# EAGLE design Frontboard_TIC (EAGLE 9.0.1)
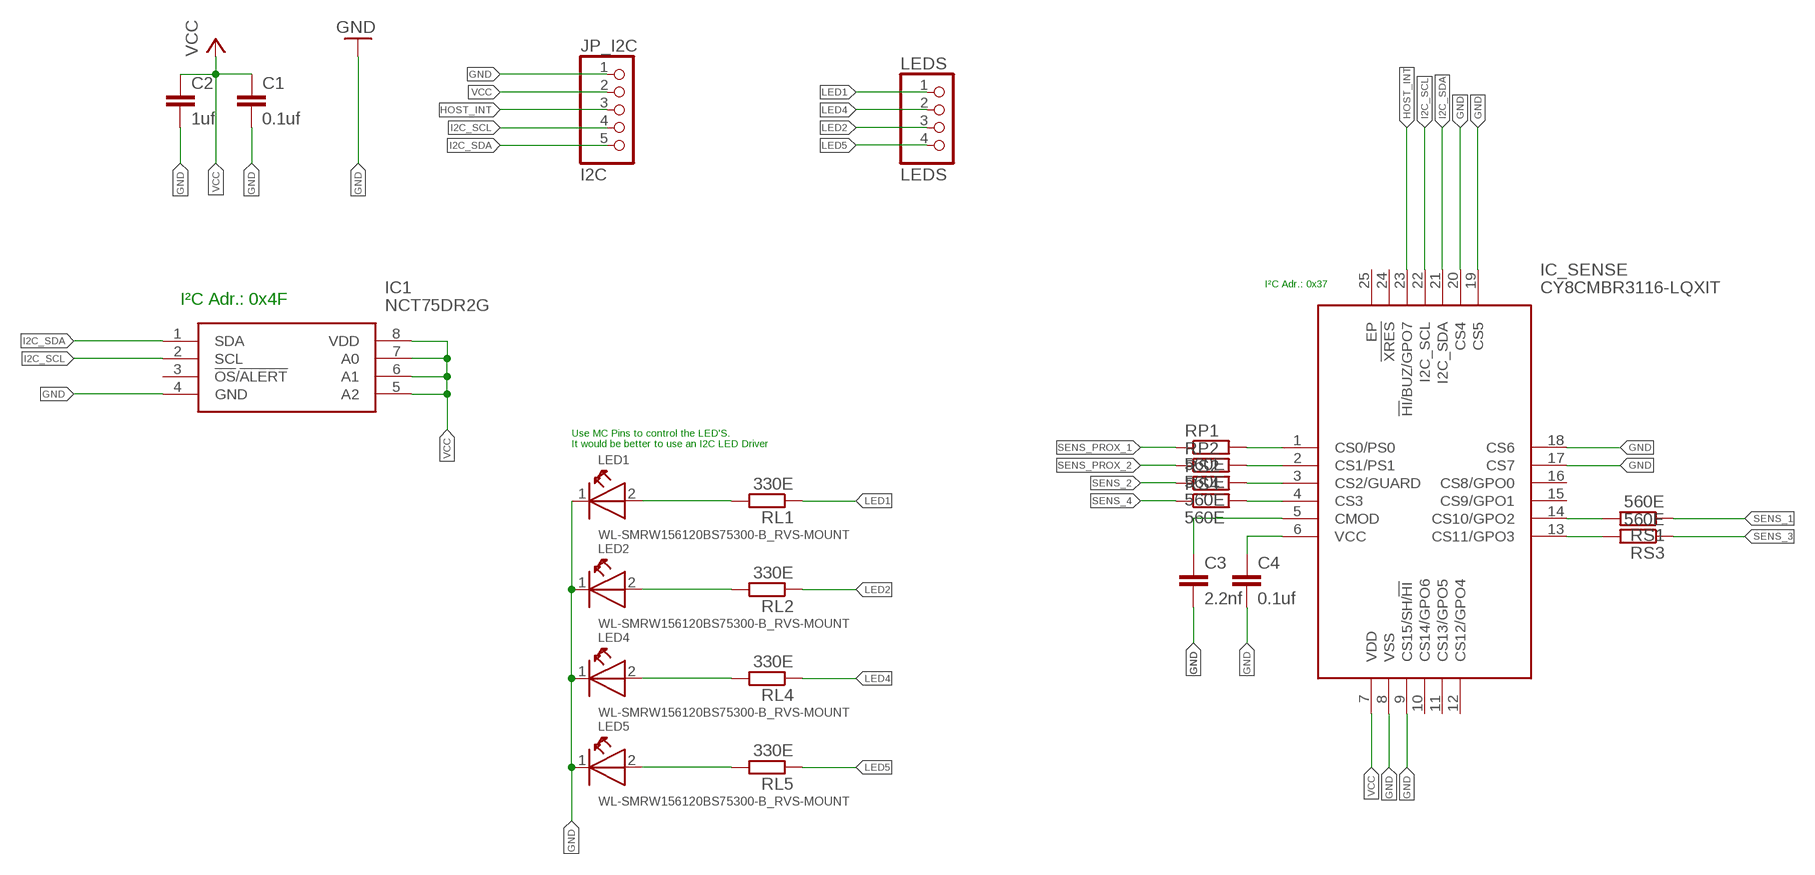
[diagram p0: schematic, sheet 1]

## Parts
C1  0.1uf  C-EUC0805  [C0805]
C2  1uf  C-EUC0805  [C0805]
C3  2.2nf  C-EUC0805  [C0805]
C4  0.1uf  C-EUC0805  [C0805]
IC1  NCT75DR2G  [SOIC127P600X175-8N]
IC_SENSE  CY8CMBR3116-LQXIT  [QFN50P400X400X60-25N]
JP_I2C  I2C  PINHD-1X5_2.54-SMD  [1X05SMD]
LED1  WL-SMRW156120BS75300-B_RVS-MOUNT  [WL-SMRW-1206-CYLDR-REVERSE-MOUNT]
LED2  WL-SMRW156120BS75300-B_RVS-MOUNT  [WL-SMRW-1206-CYLDR-REVERSE-MOUNT]
LED4  WL-SMRW156120BS75300-B_RVS-MOUNT  [WL-SMRW-1206-CYLDR-REVERSE-MOUNT]
LED5  WL-SMRW156120BS75300-B_RVS-MOUNT  [WL-SMRW-1206-CYLDR-REVERSE-MOUNT]
LEDS  LEDS  PINHD-1X4_2.54-SMD  [1X04SMD]
RL1  330E  R-EU_R0805  [R0805]
RL2  330E  R-EU_R0805  [R0805]
RL4  330E  R-EU_R0805  [R0805]
RL5  330E  R-EU_R0805  [R0805]
RP1  560E  R-EU_R0805  [R0805]
RP2  560E  R-EU_R0805  [R0805]
RS1  560E  R-EU_R0805  [R0805]
RS2  560E  R-EU_R0805  [R0805]
RS3  560E  R-EU_R0805  [R0805]
RS4  560E  R-EU_R0805  [R0805]

## Nets
GND: C1.2 C2.2 C3.2 C4.2 IC1.4(GND) IC_SENSE.8(VSS) IC_SENSE.9(CS15/SH/!HI) IC_SENSE.17(CS7) IC_SENSE.18(CS6) IC_SENSE.19(CS5) IC_SENSE.20(CS4) JP_I2C.1 LED1.1(K) LED2.1(K) LED4.1(K) LED5.1(K)
HOST_INT: IC_SENSE.23(!HI!/BUZ/GPO7) JP_I2C.3
I2C_SCL: IC1.2(SCL) IC_SENSE.22(I2C_SCL) JP_I2C.4
I2C_SDA: IC1.1(SDA) IC_SENSE.21(I2C_SDA) JP_I2C.5
LED1: LEDS.1 RL1.1
LED2: LEDS.3 RL2.1
LED4: LEDS.2 RL4.1
LED5: LEDS.4 RL5.1
N$1: LED1.2(A) RL1.2
N$2: LED2.2(A) RL2.2
N$3: IC_SENSE.14(CS10/GPO2) RS1.2
N$4: IC_SENSE.13(CS11/GPO3) RS3.2
N$5: IC_SENSE.1(CS0/PS0) RP1.2
N$6: IC_SENSE.2(CS1/PS1) RP2.2
N$7: IC_SENSE.4(CS3) RS4.2
N$8: IC_SENSE.3(CS2/GUARD) RS2.2
N$9: LED4.2(A) RL4.2
N$10: LED5.2(A) RL5.2
N$19: C4.1 IC_SENSE.6(VCC)
N$20: C3.1 IC_SENSE.5(CMOD)
SENS_1: RS1.1
SENS_2: RS2.1
SENS_3: RS3.1
SENS_4: RS4.1
SENS_PROX_1: RP1.1
SENS_PROX_2: RP2.1
VCC: C1.1 C2.1 IC1.5(A2) IC1.6(A1) IC1.7(A0) IC1.8(VDD) IC_SENSE.7(VDD) JP_I2C.2
Unconnected: IC1.3(!OS!/!ALERT) IC_SENSE.10(CS14/GPO6) IC_SENSE.11(CS13/GPO5) IC_SENSE.12(CS12/GPO4) IC_SENSE.15(CS9/GPO1) IC_SENSE.16(CS8/GPO0) IC_SENSE.24(!XRES) IC_SENSE.25(EP)

## Notes on the sheet
- I²C Adr.: 0x37
- I²C Adr.: 0x4F
- Use MC Pins to control the LED'S. 
  It would be better to use an I2C LED Driver

## Library data of the parts
C1-C4 = rcl:C-EU: CAPACITOR, European symbol; SPICEPREFIX: C
IC1 = NCT75DR2G:NCT75DR2G: Source: Datasheet <http://www.onsemi.com/pub/Collateral/NCT75-D.PDF>; ALLIED_NUMBER: 70467171; ALLIED_PRICE/STOCK: http://www.alliedelec.com/on-semiconductor-nct75dr2g/70467171/; ARROW_PART_NUMBER: NCT75DR2G; ARROW_PRICE/STOCK: https://www.arrow.com/en/products/nct75dr2g/on-semiconductor; HEIGHT: 1.75mm; MANUFACTURER_NAME: ON Semiconductor; MANUFACTURER_PART_NUMBER: NCT75DR2G; RS_PART_NUMBER: 8051854P; RS_PRICE/STOCK: http://uk.rs-online.com/web/p/products/8051854P
IC_SENSE = CY8CMBR3116-LQXIT:CY8CMBR3116-LQXIT: CYPRESS SEMICONDUCTOR - CY8CMBR3116-LQXIT - CAPACITIVE TOUCH SENSOR, I2C, QFN-24 Source: Datasheet <http://www.cypress.com/file/46236/download>; ARROW_PART_NUMBER: CY8CMBR3116-LQXIT; ARROW_PRICE/STOCK: https://www.arrow.com/en/products/cy8cmbr3116-lqxit/cypress-semiconductor; DESCRIPTION: CYPRESS SEMICONDUCTOR - CY8CMBR3116-LQXIT - CAPACITIVE TOUCH SENSOR, I2C, QFN-24; HEIGHT: 0.6mm; MANUFACTURER_NAME: Cypress Semiconductor; MANUFACTURER_PART_NUMBER: CY8CMBR3116-LQXIT
JP_I2C = pinhead:PINHD-1X5: PIN HEADER
LED1 LED2 LED4 LED5 = Wurth_Elektronik_Optoelectronics_rev15b (1):WL-SMRW: SMD Reverse mount mono-color rectangular Characteristics Small size & thin body for space saving Ideal for narrow space applications Wide viewing angle Low power consumption Industry standard footprint Small package for exceptional brightness To emit light through a small cut-out hole in PCB Compatible with automatic placement machine Applications Front panel indicators LCD backlighting Keypad backlighting Push button backlighting Symbol and switch backlighting General lighting <http://katalog.we-online.de/media/images/eipal/WL-SMRW_pf2.jpg> Details see: http://katalog.we-online.de/en/led/WL-SMRW?m Updated 2015-04-10 2015 (C) Wurth Elektronik
LEDS = pinhead:PINHD-1X4: PIN HEADER
RL1 RL2 RL4 RL5 RP1 RP2 RS1-RS4 = resistor:R-EU_: RESISTOR, European symbol

## Net classes
0 default: width 0.203 mm

## Board
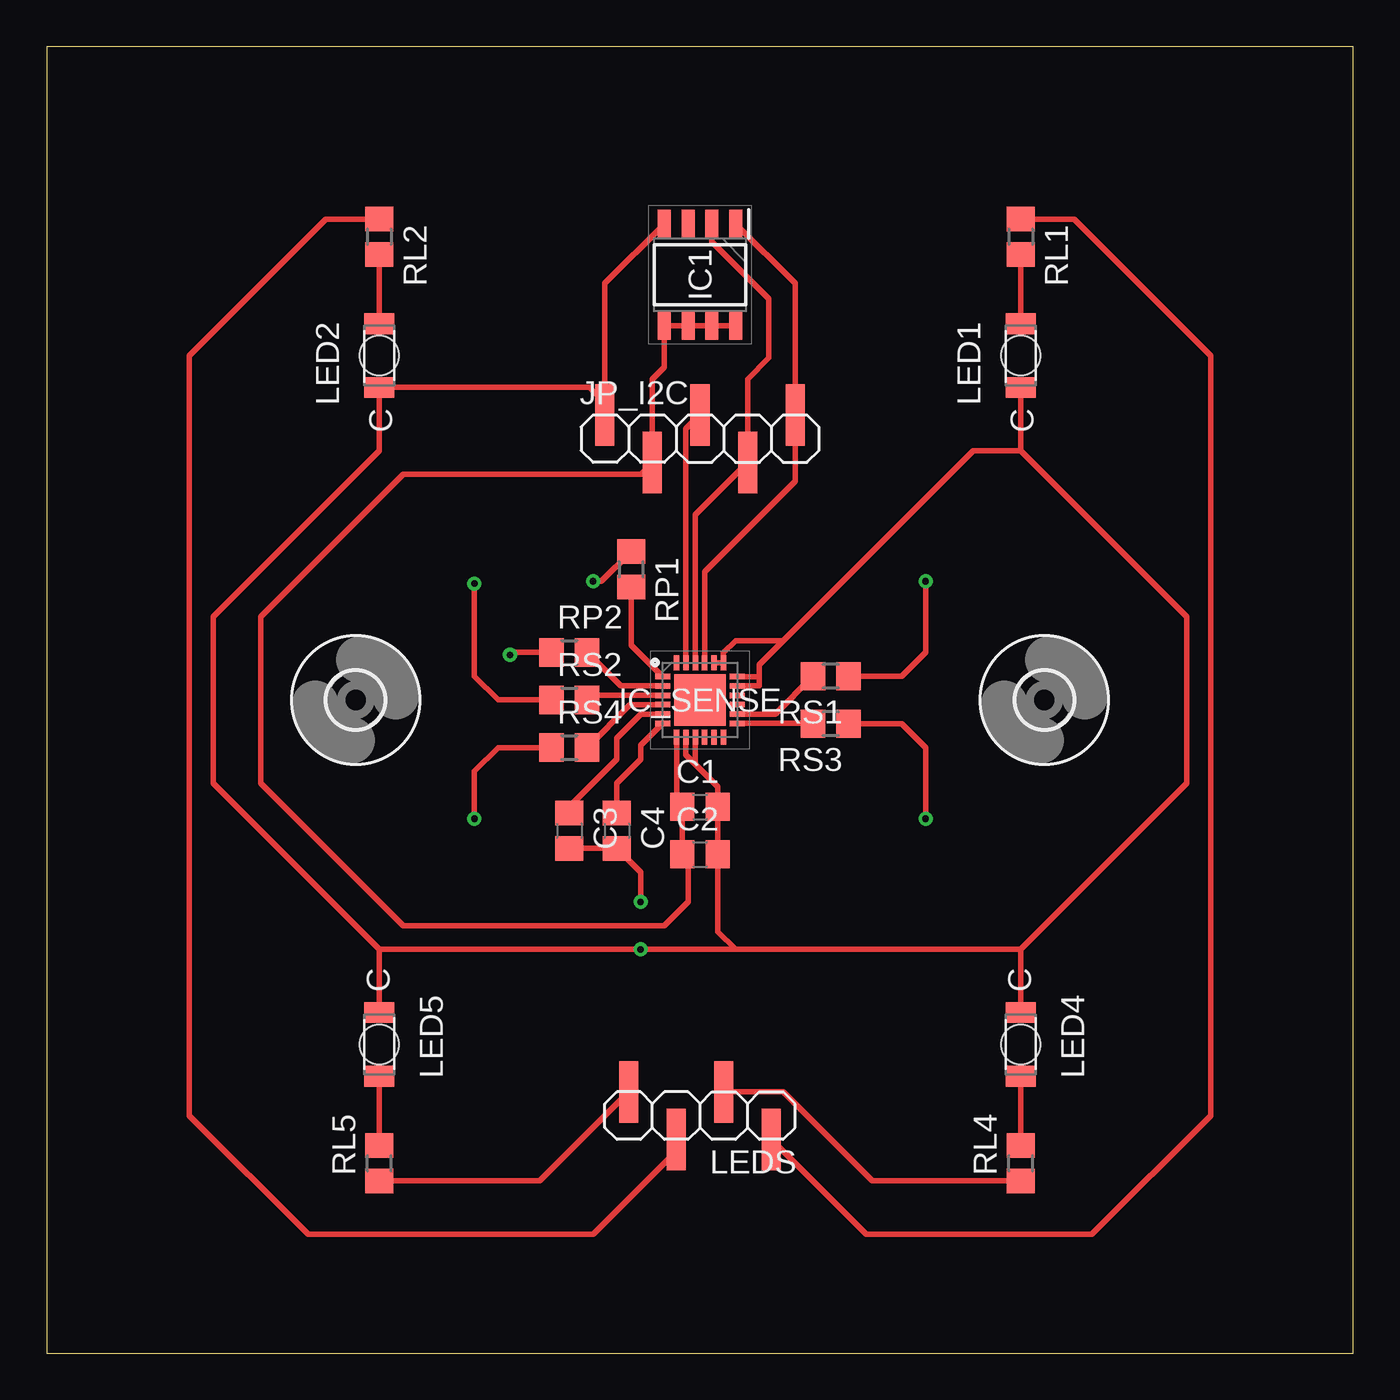
[diagram p1: board, top side]
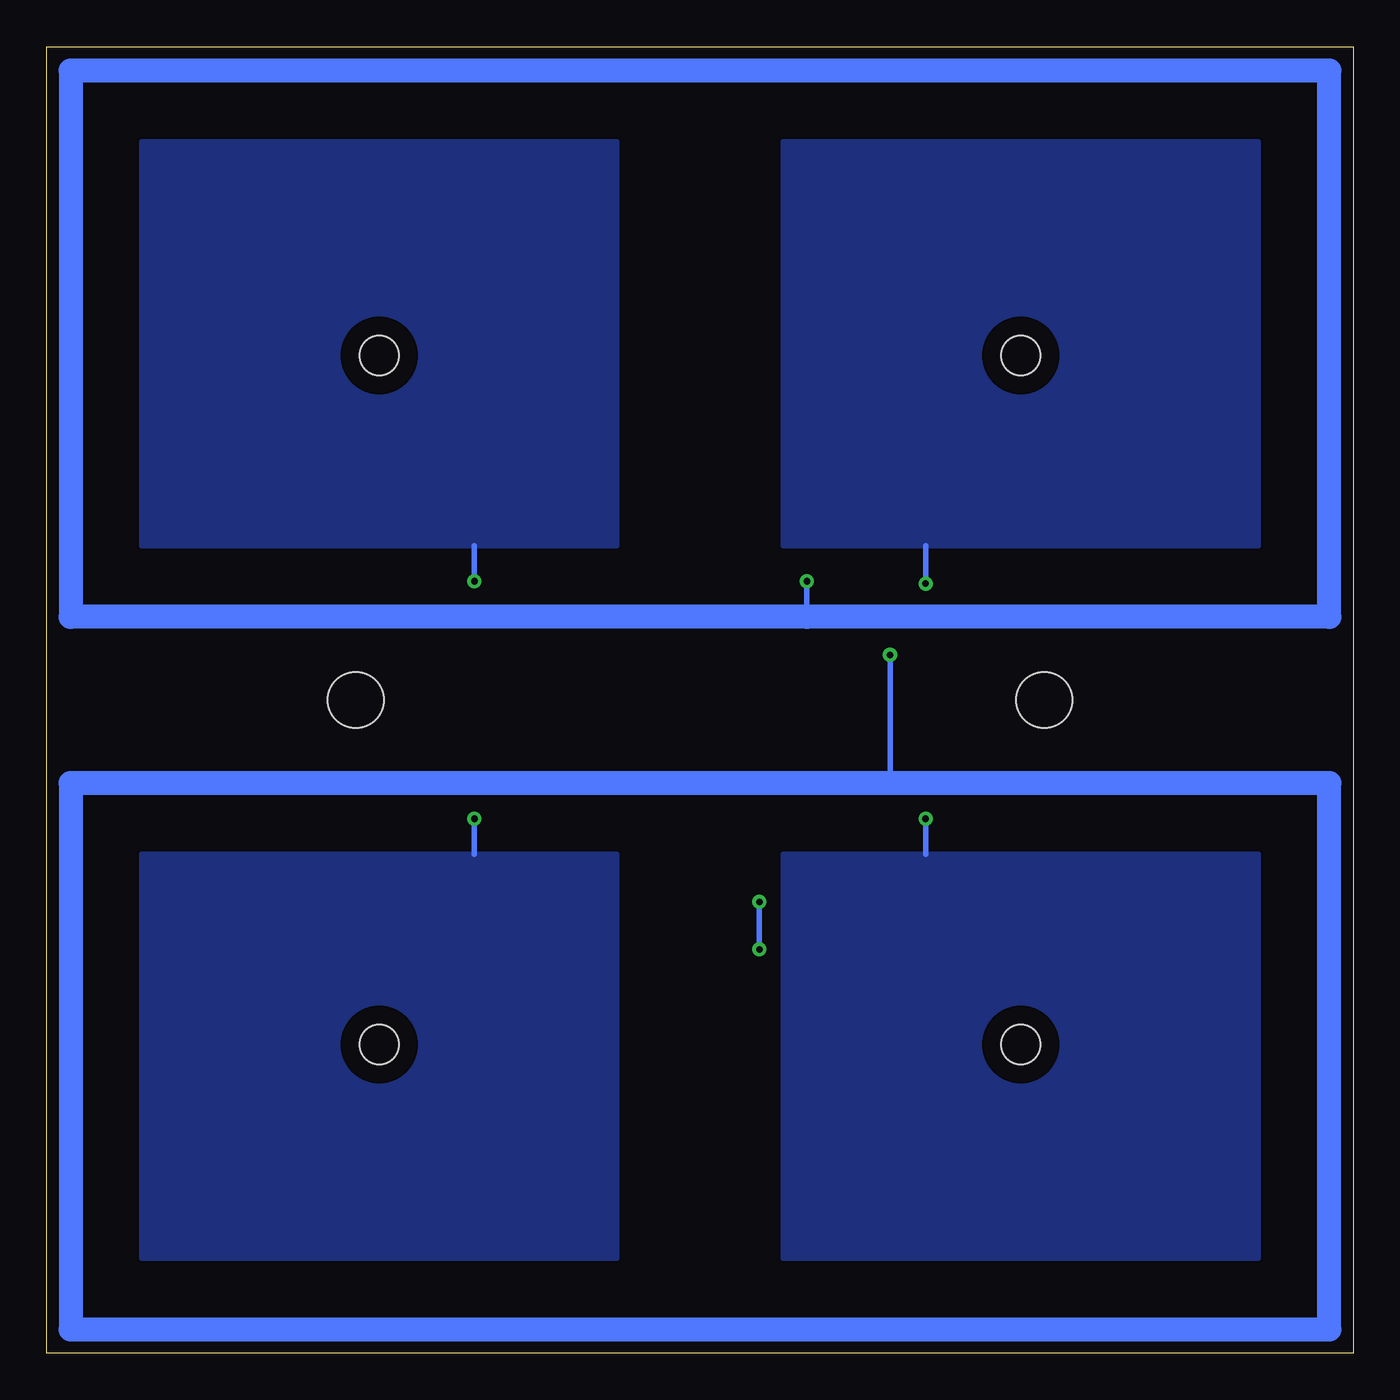
[diagram p2: board, bottom side, seen from below]

Size 69.85 x 69.85 mm. Coordinates in mm from the lower left corner, seen from the top.
Outline: 0,0 69.85,0 69.85,69.85 0,69.85 0,0
Copper layers (1*16): Top 0.035mm / dielectric 1.5mm / Bottom 0.035mm
Design rules "default": minimum track width 6mil, minimum drill 0.35mm, track to track 6mil, track to pad 6mil, pad to pad 6mil, via to via 6mil, smd to smd 6mil, copper to edge 40mil, drill to drill 6mil, minimum pad ring 10mil, minimum via ring 8mil, stop-mask expansion 4mil, vias tented up to drill 0mil, thermal gap 10mil

### Footprints (pad centres in the part's own frame; a part is rotated, then mirrored left to right if it is on the bottom)
C0805 = smd 1.3 x 1.5: 1 -0.95,0; 2 0.95,0
SOIC127P600X175-8N = smd 1.525 x 0.7: 1 -2.712,1.905; 2 -2.712,0.635; 3 -2.712,-0.635; 4 -2.712,-1.905; 5 2.712,-1.905; 6 2.712,-0.635; 7 2.712,0.635; 8 2.712,1.905
QFN50P400X400X60-25N = smd 0.8 x 0.3: 1 -2,1.25; 2 -2,0.75; 3 -2,0.25; 4 -2,-0.25; 5 -2,-0.75; 6 -2,-1.25; 13 2,-1.25; 14 2,-0.75; 15 2,-0.25; 16 2,0.25; 17 2,0.75; 18 2,1.25 | smd 0.3 x 0.8: 7 -1.25,-2; 8 -0.75,-2; 9 -0.25,-2; 10 0.25,-2; 11 0.75,-2; 12 1.25,-2; 19 1.25,2; 20 0.75,2; 21 0.25,2; 22 -0.25,2; 23 -0.75,2; 24 -1.25,2 | smd 2.75 x 2.75: 25 0,0
1X05SMD = smd 1.016 x 3.302: 1 -1.27,1.27; 2 1.27,-1.27; 3 3.81,1.27; 4 6.35,-1.27; 5 8.89,1.27
WL-SMRW-1206-CYLDR-REVERSE-MOUNT = smd 1.1 x 1.6: 1 -1.7,0; 2 1.7,0 | hole 2.1: 0,0
1X04SMD = smd 1.016 x 3.302: 1 -1.27,1.27; 2 1.27,-1.27; 3 3.81,1.27; 4 6.35,-1.27
R0805 = smd 1.3 x 1.5: 1 -0.95,0; 2 0.95,0
3,0 = hole 3: 0,0

### Placement (x,y rotation side)
C1  34.92,29.21 0 top
C2  34.92,26.67 0 top
C3  27.94,27.94 270 top
C4  30.48,27.94 270 top
IC1  34.92,57.66 270 top
IC_SENSE  34.92,34.92 0 top
JP_I2C  31.11,48.9 0 top
LED1  52.07,53.34 90 top
LED2  17.78,53.34 90 top
LED4  52.07,16.51 270 top
LED5  17.78,16.51 270 top
LEDS  37.47,12.7 180 top
RL1  52.07,59.69 270 top
RL2  17.78,59.69 270 top
RL4  52.07,10.16 90 top
RL5  17.78,10.16 90 top
RP1  31.24,41.91 270 top
RP2  27.94,37.47 0 top
RS1  41.91,36.2 180 top
RS2  27.94,34.92 0 top
RS3  41.91,33.66 180 top
RS4  27.94,32.38 0 top
U$1  [3,0]  16.51,34.92 0 top
U$2  [3,0]  53.34,34.92 0 top

### Tracks (layer width: path | path; a pad name or v marks a point on that pad's centre or on a via)
GND  (via drill 0.35)
  Top 0.305: 17.78,21.59 8.89,30.48 8.89,39.37 17.78,48.26 LED2.1 29,51.64 29.84,50.8 | 52.07,48.26 60.96,39.37 60.96,30.48 52.07,21.59 | 35.81,29.27 C1.2 | IC_SENSE.17 38.09,35.67 38.09,36.17 38.08,36.17 | 38.08,36.17 IC_SENSE.18 | 39.37,38.1 36.83,38.1 36.17,37.45 IC_SENSE.19 IC_SENSE.20 | 39.37,38.1 49.53,48.26 52.07,48.26 | C1.2 35.88,30.29 34.67,31.5 | 34.67,31.5 IC_SENSE.9 | IC_SENSE.8 34.17,31.99 34.67,31.5 | C3.2 C4.2 31.75,25.72 v31.75,24.13 | 17.78,21.59 v31.75,21.59 36.83,21.59 | 36.83,21.59 52.07,21.59 | 36.83,21.59 35.88,22.55 C2.2 C1.2 | 38.08,36.17 38.08,36.81 39.37,38.1 | IC1.4 29.84,57.2 29.84,50.8 | 29.84,50.8 JP_I2C.1 | 52.07,48.26 LED1.1 | LED5.1 17.78,21.59 | LED4.1 52.07,21.59
  Bottom 0.305: v31.75,24.13 v31.75,21.59
HOST_INT
  Top 0.305: IC_SENSE.23 34.17,49.41 JP_I2C.3
I2C_SCL
  Top 0.305: 35.56,59.69 IC1.2 35.56,59.44 38.61,56.39 38.61,53.21 37.47,52.07 JP_I2C.4 34.67,44.84 IC_SENSE.22
I2C_SDA
  Top 0.305: IC1.1 40.01,57.2 JP_I2C.5 40.01,46.61 35.17,41.78 IC_SENSE.21
LED1
  Top 0.305: RL1.1 54.93,60.64 62.23,53.34 62.23,12.7 55.88,6.35 43.81,6.35 LEDS.1
LED2
  Top 0.305: RL2.1 14.92,60.64 7.62,53.34 7.62,12.7 13.97,6.35 29.21,6.35 33.66,10.79 LEDS.3
LED4
  Top 0.305: RL4.1 48.26,9.21 47.94,9.21 44.13,9.21 39.37,13.97 LEDS.2
LED5
  Top 0.305: RL5.1 26.36,9.21 LEDS.4
N$1
  Top 0.305: LED1.2 RL1.2
N$2
  Top 0.305: LED2.2 RL2.2
N$3
  Top 0.305: IC_SENSE.14 38.94,34.17 RS1.2
N$4
  Top 0.305: IC_SENSE.13 40.94,33.67 RS3.2
N$5
  Top 0.305: 32.13,36.97 IC_SENSE.1 31.24,37.86 RP1.2
N$6
  Top 0.305: IC_SENSE.2 30.68,35.67 RP2.2
N$7
  Top 0.305: IC_SENSE.4 31.18,34.67 RS4.2
N$8
  Top 0.305: IC_SENSE.3 arc-90 IC_SENSE.3 29.14,35.17 RS2.2
N$9
  Top 0.305: RL4.2 LED4.2
N$10
  Top 0.305: RL5.2 LED5.2
N$19
  Top 0.305: IC_SENSE.6 31.75,32.5 31.75,31.75 30.48,30.48 C4.1
N$20
  Top 0.305: IC_SENSE.5 31.76,34.17 30.48,32.89 30.48,31.75 27.94,29.21 C3.1
SENS_1  (via drill 0.35)
  Top 0.305: RS1.1 45.72,36.2 46.99,37.47 v46.99,41.27
  Bottom 0.305: v46.99,41.27 46.99,43.18
  pour Bottom: 64.77,43.18 64.77,64.77 39.37,64.77 39.37,43.18
SENS_2  (via drill 0.35)
  Top 0.305: RS2.1 24.13,34.92 22.86,36.2 v22.86,41.15
  Bottom 0.305: v22.86,41.15 22.86,43.18
  pour Bottom: 5.08,43.18 30.48,43.18 30.48,64.77 5.08,64.77
SENS_3  (via drill 0.35)
  Top 0.305: RS3.1 45.72,33.66 46.99,32.38 v46.99,28.57
  Bottom 0.305: v46.99,28.57 46.99,26.67
  pour Bottom: 39.37,26.67 64.77,26.67 64.77,5.08 39.37,5.08
SENS_4  (via drill 0.35)
  Top 0.305: RS4.1 24.13,32.38 22.86,31.11 v22.86,28.57
  Bottom 0.305: v22.86,28.57 22.86,26.67
  pour Bottom: 5.08,26.67 30.48,26.67 30.48,5.08 5.08,5.08
SENS_PROX_1  (via drill 0.35)
  Top 0.305: RP1.1 29.66,41.27 v29.21,41.27
  Bottom 0.305: v29.21,41.27 29.21,39.37
  Bottom 1.27: 1.27,68.58 68.58,68.58 68.58,39.37 29.21,39.37 1.27,39.37 1.27,68.58
SENS_PROX_2  (via drill 0.35)
  Top 0.305: RP2.1 24.77,37.47 v24.77,37.34
  Bottom 0.305: v24.77,37.34 24.77,30.48
  Bottom 1.27: 68.58,1.27 1.27,1.27 1.27,30.48 24.77,30.48 68.58,30.48 68.58,1.27
VCC
  Top 0.305: C1.1 33.67,29.51 IC_SENSE.7 | 33.66,28.89 C1.1 | 33.66,26.35 C2.1 | C2.1 C1.1 | C2.1 34.29,26.36 34.29,24.13 33.02,22.86 19.05,22.86 11.43,30.48 11.43,39.37 19.05,46.99 31.75,46.99 JP_I2C.2 32.38,52.07 33.02,52.7 IC1.5 IC1.6 IC1.8 IC1.7